# EAGLE design servo_controller_pi (EAGLE 6.4)
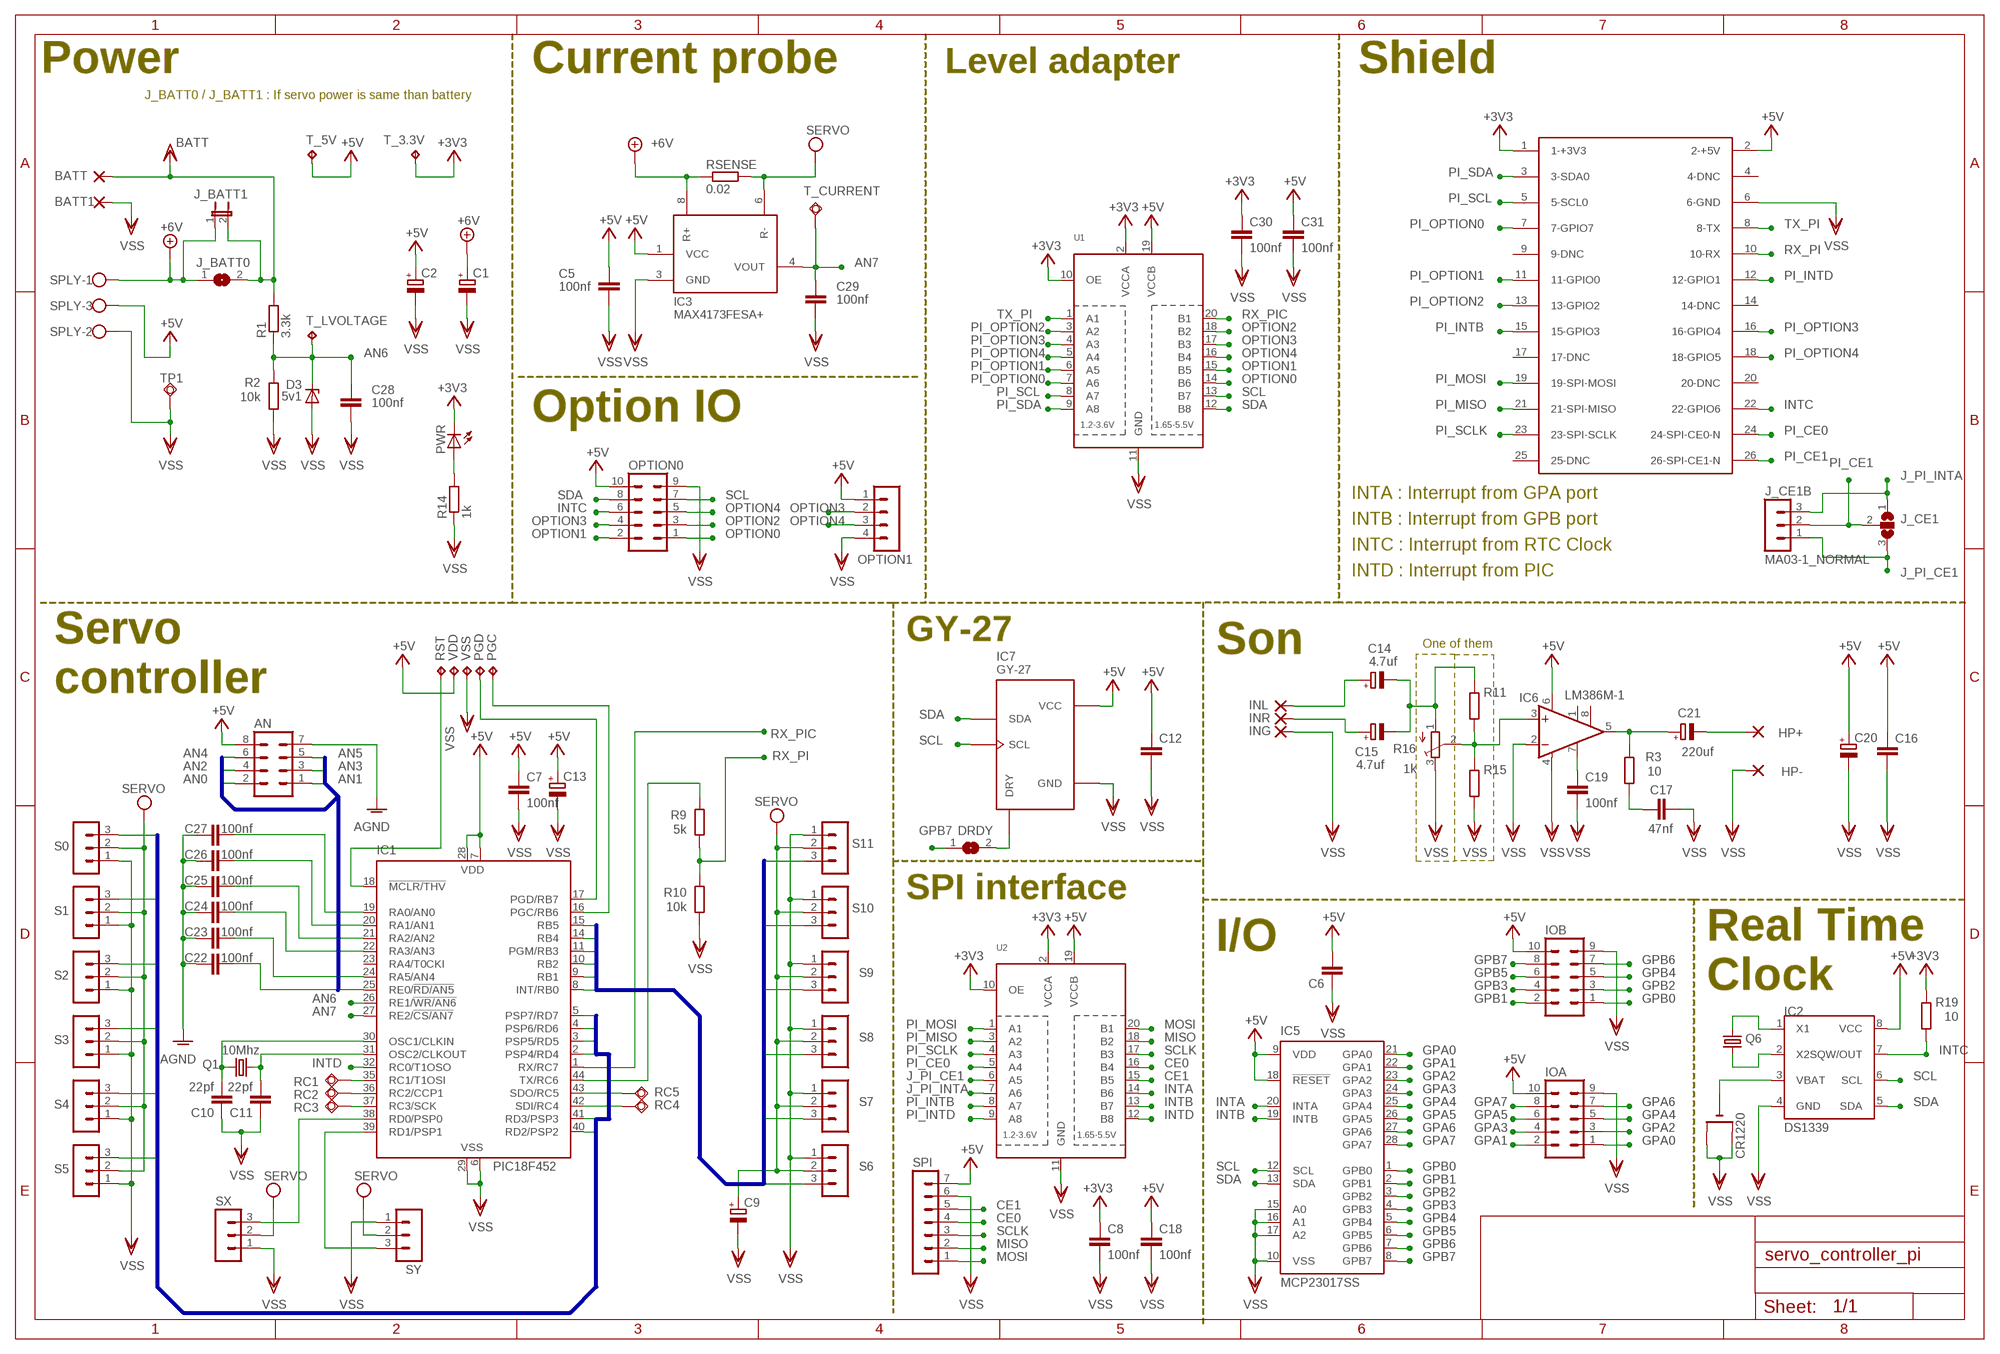
[diagram p0: schematic, sheet 1]

## Parts
AN  MA04-2  [MA04-2]
BATT  2,15/1,0  [2,15/1,0]
BATT1  2,15/1,0  [2,15/1,0]
C1  CPOL-EUF  [PANASONIC_F]
C2  CPOL-EUF  [PANASONIC_F]
C5  100nf  C-EUC0805  [C0805]
C6  C-EUC0805  [C0805]
C7  100nf  C-EUC0805  [C0805]
C8  100nf  C-EUC0805  [C0805]
C9  CPOL-EUD  [PANASONIC_D]
C10  22pf  C-EUC0805  [C0805]
C11  22pf  C-EUC0805  [C0805]
C12  C-EUC0805  [C0805]
C13  CPOL-EUA  [PANASONIC_A]
C14  4.7uf  CPOL-EUA  [PANASONIC_A]
C15  4.7uf  CPOL-EUA  [PANASONIC_A]
C16  C-EUC0805  [C0805]
C17  47nf  C-EUC0805  [C0805]
C18  100nf  C-EUC0805  [C0805]
C19  100nf  C-EUC0805  [C0805]
C20  CPOL-EUA  [PANASONIC_A]
C21  220uf  CPOL-EUD  [PANASONIC_D]
C22  100nf  C-EUC0805  [C0805]
C23  100nf  C-EUC0805  [C0805]
C24  100nf  C-EUC0805  [C0805]
C25  100nf  C-EUC0805  [C0805]
C26  100nf  C-EUC0805  [C0805]
C27  100nf  C-EUC0805  [C0805]
C28  100nf  C-EUC0805  [C0805]
C29  100nf  C-EUC0805  [C0805]
C30  100nf  C-EUC0805  [C0805]
C31  100nf  C-EUC0805  [C0805]
CR1220  CR1220THM  [CR1220-THM]
D3  5v1  ZENER-DIODESOT23  [SOT23]
DRDY  SJ  [SJ]
HP+  2,15/1,0  [2,15/1,0]
HP-  2,15/1,0  [2,15/1,0]
IC1  PIC18F452  PIC16F877PT  [TQFP44]
IC2  DS1339  DS1307  [SOIC-8]
IC3  MAX4173FESA+  MAX4173A  [SO08]
IC5  MCP23017SS  [SSOP28]
IC6  LM386M-1  [SO08]
IC7  GY-27  [GY-27]
ING  2,15/1,0  [2,15/1,0]
INL  2,15/1,0  [2,15/1,0]
INR  2,15/1,0  [2,15/1,0]
IOA  MA05-2  [MA05-2]
IOB  MA05-2  [MA05-2]
J_BATT0  SJ  [SJ]
J_BATT1  JP1E  [JP1]
J_CE1  SJ2W  [SJ_2]
J_CE1B  MA03-1_NORMAL  [MA03-1_NORMAL]
OPTION0  MA05-2  [MA05-2]
OPTION1  MA04-1  [MA04-1]
PGC  TPTP20R  [TP20R]
PGD  TPTP20R  [TP20R]
PWR  LEDCHIPLED_0805  [CHIPLED_0805]
Q1  10Mhz  CRYTALHC49UP  [HC49UP@1]
Q6  CRYSTALTC26H  [TC26H]
R1  3.3k  R-EU_M0805  [M0805]
R2  10k  R-EU_M0805  [M0805]
R3  10  R-EU_M0805  [M0805]
R9  5k  R-EU_M0805  [M0805]
R10  10k  R-EU_M0805  [M0805]
R11  R-EU_M0805  [M0805]
R14  1k  R-EU_M0805  [M0805]
R15  R-EU_M0805  [M0805]
R16  1k  TRIM_EU-3223J  [3223J]
R19  10  R-EU_M0805  [M0805]
RC1  TPSQTP06SQ  [TP06SQ]
RC2  TPSQTP06SQ  [TP06SQ]
RC3  TPSQTP06SQ  [TP06SQ]
RC4  TPSQTP06SQ  [TP06SQ]
RC5  TPSQTP06SQ  [TP06SQ]
RSENSE  0.02  R-EU_R4527  [R4527]
RST  TPTP20R  [TP20R]
S0  MA03-1  [MA03-1]
S1  MA03-1  [MA03-1]
S2  MA03-1  [MA03-1]
S3  MA03-1  [MA03-1]
S4  MA03-1  [MA03-1]
S5  MA03-1  [MA03-1]
S6  MA03-1  [MA03-1]
S7  MA03-1  [MA03-1]
S8  MA03-1  [MA03-1]
S9  MA03-1  [MA03-1]
S10  MA03-1  [MA03-1]
S11  MA03-1  [MA03-1]
SPI  MA07-1  [MA07-1]
SPLY  W237-103  [W237-103]
SX  MA03-1  [MA03-1]
SY  MA03-1  [MA03-1]
T_3.3V  TPB1,27  [B1,27]
T_5V  TPB1,27  [B1,27]
T_CURRENT  TPSQPAD1-13  [P1-13]
T_LVOLTAGE  TPB1,27  [B1,27]
TP1  TPSQPAD1-13  [P1-13]
U1  TXB0108PWR  [TSSOP20]
U2  TXB0108PWR  [TSSOP20]
U$3  RASPBERRY-PILIGHT-HOLE  [RASPBERRY-PI-LIGHT-HOLE]
VDD  TPTP20R  [TP20R]
VSS  TPTP20R  [TP20R]

## Nets
+3V3: C8.1 C30.1 PWR.C R19.2 T_3.3V.TP U1.2(VCCA) U1.10(OE) U2.2(VCCA) U2.10(OE) U$3.1(1-+3V3)
+5V: AN.8 C2.+ C5.1 C6.2 C7.1 C12.1 C13.+ C16.1 C18.1 C20.+ C31.1 IC1.7(VDD) IC1.28(VDD) IC2.8(VCC) IC3.1(VCC) IC5.9(VDD) IC5.18(!RESET) IC6.6(VS) IC7.VCC IOA.10 IOB.10 OPTION0.10 OPTION1.1 SPI.7 SPLY.3 T_5V.TP U1.19(VCCB) U2.19(VCCB) U$3.2(2-+5V) VDD.TP
+7V: C1.+ IC3.8(R+) J_BATT0.1 J_BATT1.1 RSENSE.1 SPLY.1 ; supply symbol labelled +6V
AGND: AN.7 C22.1 C23.1 C24.1 C25.1 C26.1 C27.1
AN0: AN.2 C27.2 IC1.19(RA0/AN0)
AN1: AN.1 C26.2 IC1.20(RA1/AN1)
AN2: AN.4 C25.2 IC1.21(RA2/AN2)
AN3: AN.3 C24.2 IC1.22(RA3/AN3)
AN4: AN.6 C23.2 IC1.24(RA5/AN4)
AN5: AN.5 C22.2 IC1.25(RE0/!RD/AN5)
AN6: C28.2 D3.3(C) IC1.26(RE1/!WR/AN6) R1.1 R2.2 T_LVOLTAGE.TP
AN7: C29.2 IC1.27(RE2/!CS/AN7) IC3.4(VOUT) T_CURRENT.TP
CE0: SPI.4 U2.16(B4)
CE1: SPI.5 U2.15(B5)
GPA0: IC5.21(GPA0) IOA.1
GPA1: IC5.22(GPA1) IOA.2
GPA2: IC5.23(GPA2) IOA.3
GPA3: IC5.24(GPA3) IOA.4
GPA4: IC5.25(GPA4) IOA.5
GPA5: IC5.26(GPA5) IOA.6
GPA6: IC5.27(GPA6) IOA.7
GPA7: IC5.28(GPA7) IOA.8
GPB0: IC5.1(GPB0) IOB.1
GPB1: IC5.2(GPB1) IOB.2
GPB2: IC5.3(GPB2) IOB.3
GPB3: IC5.4(GPB3) IOB.4
GPB4: IC5.5(GPB4) IOB.5
GPB5: IC5.6(GPB5) IOB.6
GPB6: IC5.7(GPB6) IOB.7
GPB7: DRDY.1 IC5.8(GPB7) IOB.8
INTA: IC5.20(INTA) U2.14(B6)
INTB: IC5.19(INTB) U2.13(B7)
INTC: IC2.7(SQW/OUT) OPTION0.6 R19.1 U$3.22(22-GPIO6)
INTD: IC1.32(RC0/T1OSO) U2.12(B8)
J_PI_CE1: J_CE1.3 J_CE1B.1 U2.6(A5)
J_PI_INTA: J_CE1.1 J_CE1B.3 U2.7(A6)
MISO: SPI.2 U2.18(B2)
MOSI: SPI.1 U2.20(B1)
N$1: IC1.35(RC1/T1OSI) RC1.TP
N$2: IC1.36(RC2/CCP1) RC2.TP
N$3: IC1.37(RC3/SCK) RC3.TP
N$7: C14.- C15.- R11.2 R16.1(A)
N$8: C14.+ INL.1(P)
N$9: C21.- HP+.1(P)
N$16: IC1.44(TX/RC6) R9.2
N$19: IC1.38(RD0/PSP0) SX.3
N$22: IC1.17(PGD/RB7) PGD.TP
N$23: IC1.16(PGC/RB6) PGC.TP
N$24: IC1.39(RD1/PSP1) SY.3
N$25: C11.2 IC1.31(OSC2/CLKOUT) Q1.1
N$27: C10.2 IC1.30(OSC1/CLKIN) Q1.2
N$33: IC2.1(X1) Q6.1
N$34: IC2.2(X2) Q6.2
N$36: DRDY.2 IC7.DRY
N$39: PWR.A R14.2
N$40: C15.+ INR.1(P)
N$41: IC6.3(+IN) R11.1 R15.2 R16.2(S)
N$42: C21.+ IC6.5(OUT) R3.2
N$43: C17.1 R3.1
N$47: C19.1 IC6.7(BYPASS)
N$55: IC1.42(SDI/RC4) RC4.TP
N$56: IC1.43(SDO/RC5) RC5.TP
N$58: CR1220.- IC2.3(VBAT)
OPTION0: OPTION0.1 U1.14(B6)
OPTION1: OPTION0.2 U1.15(B5)
OPTION2: OPTION0.3 U1.18(B2)
OPTION3: OPTION0.4 OPTION1.2 U1.17(B3)
OPTION4: OPTION0.5 OPTION1.3 U1.16(B4)
PI_CE0: U2.5(A4) U$3.24(24-SPI-CE0-N)
PI_CE1: J_CE1.2 J_CE1B.2 U$3.26(26-SPI-CE1-N)
PI_INTB: U2.8(A7) U$3.15(15-GPIO3)
PI_INTD: U2.9(A8) U$3.12(12-GPIO1)
PI_MISO: U2.3(A2) U$3.21(21-SPI-MISO)
PI_MOSI: U2.1(A1) U$3.19(19-SPI-MOSI)
PI_OPTION0: U1.7(A6) U$3.7(7-GPIO7)
PI_OPTION1: U1.6(A5) U$3.11(11-GPIO0)
PI_OPTION2: U1.3(A2) U$3.13(13-GPIO2)
PI_OPTION3: U1.4(A3) U$3.16(16-GPIO4)
PI_OPTION4: U1.5(A4) U$3.18(18-GPIO5)
PI_SCL: U1.8(A7) U$3.5(5-SCL0)
PI_SCLK: U2.4(A3) U$3.23(23-SPI-SCLK)
PI_SDA: U1.9(A8) U$3.3(3-SDA0)
RX_PI: R9.1 R10.2 U$3.10(10-RX)
RX_PIC: IC1.1(RX/RC7) U1.20(B1)
SCL: IC2.6(SCL) IC5.12(SCL) IC7.SCL OPTION0.7 U1.13(B7)
SCLK: SPI.3 U2.17(B3)
SDA: IC2.5(SDA) IC5.13(SDA) IC7.SDA OPTION0.8 U1.12(B8)
SS0: IC1.40(RD2/PSP2) S0.3
SS1: IC1.41(RD3/PSP3) S1.3
SS2: IC1.2(PSP4/RD4) S2.3
SS3: IC1.3(PSP5/RD5) S3.3
SS4: IC1.4(PSP6/RD6) S4.3
SS5: IC1.5(PSP7/RD7) S5.3
SS6: IC1.8(INT/RB0) S6.3
SS7: IC1.9(RB1) S7.3
SS8: IC1.10(RB2) S8.3
SS9: IC1.11(PGM/RB3) S9.3
SS10: IC1.14(RB4) S10.3
SS11: IC1.15(RB5) S11.3
TX_PI: U1.1(A1) U$3.8(8-TX)
UC_RESET: IC1.18(!MCLR/THV) RST.TP
VDD: BATT.1(P) J_BATT0.2 J_BATT1.2 R1.2 ; supply symbol labelled BATT
VEE: C9.+ IC3.6(R-) RSENSE.2 S0.2 S1.2 S2.2 S3.2 S4.2 S5.2 S6.2 S7.2 S8.2 S9.2 S10.2 S11.2 SX.2 SY.2 ; supply symbol labelled SERVO
VSS: BATT1.1(P) C1.- C2.- C5.2 C6.1 C7.2 C8.2 C9.- C10.1 C11.1 C12.2 C13.- C16.2 C17.2 C18.2 C19.2 C20.- C28.1 C29.1 C30.2 C31.2 CR1220.+1(+) CR1220.+2(+1) D3.1(A) HP-.1(P) IC1.6(VSS) IC1.29(VSS) IC2.4(GND) IC3.3(GND) IC5.10(VSS) IC5.15(A0) IC5.16(A1) IC5.17(A2) IC6.2(-IN) IC6.4(GND) IC7.GND ING.1(P) IOA.9 IOB.9 OPTION0.9 OPTION1.4 R2.1 R10.1 R14.1 R15.1 R16.3(E) S0.1 S1.1 S2.1 S3.1 S4.1 S5.1 S6.1 S7.1 S8.1 S9.1 S10.1 S11.1 SPI.6 SPLY.2 SX.1 SY.1 TP1.TP U1.11(GND) U2.11(GND) U$3.6(6-GND) VSS.TP
Unconnected: IC1.23(RA4/T0CKI) IC6.1(GAIN) IC6.8(GAIN) U$3.4(4-DNC) U$3.9(9-DNC) U$3.14(14-DNC) U$3.17(17-DNC) U$3.20(20-DNC) U$3.25(25-DNC)

## Buses
SS[0..5]
SS[6..11]
AN[0..5]

## Notes on the sheet
- Power | Current probe | Level adapter | Shield
- J_BATT0 / J_BATT1 : If servo power is same than battery
- Option IO
- INTA : Interrupt from GPA port
- INTB : Interrupt from GPB port
- INTC : Interrupt from RTC Clock
- INTD : Interrupt from PIC
- GY-27
- One of them
- Son
- Servo
  controller
- SPI interface
- I/O
- Real Time
  Clock

## Library data of the parts
AN = con-lstb:MA04-2: PIN HEADER; OC_FARNELL: unknown; OC_NEWARK: unknown
BATT BATT1 HP+ HP- ING INL INR = wirepad:2,15/1,0: THROUGH-HOLE PAD
C1 C2 C9 C13-C15 C20 C21 = rcl:CPOL-EU: POLARIZED CAPACITOR, European symbol
C5-C8 C10-C12 C16-C19 C22-C31 = rcl:C-EU: CAPACITOR, European symbol
CR1220 = adafruit:CR1220: CR1216/CR1220/CR1225 12mm 3V lithium coin cell Great for battery packup. Both SMT and THM holders. Note the THM package has the ground pads on both sides of the PCB so that the masks are the same - this reduces the cost
D3 = diode:ZENER-DIODE: Z-Diode
DRDY J_BATT0 = jumper:SJ: SMD solder JUMPER
IC1 = microchip:PIC16F87*: MICROCONTROLLER; MF: MICROCHIP; MPN: PIC16F877-04/PQ; OC_FARNELL: 9761411; OC_NEWARK: 23C5094
IC2 = eagleParts:DS1307: I2C Serial RTC w/56 bytes battery backed RAM
IC3 = AWJLEagleLib:MAX4173: Maxim MAX4173 high side current monitor SOT363 pin 2 goes to GND
IC5 = adafruit:MCP23017: http://ww1.microchip.com/downloads/en/DeviceDoc/21952a.pdf Source: http://ww1.microchip.com/downloads/en/DeviceDoc/21952a.pdf
IC6 = linear:LM386?-*: Low Voltage Audio Power Amplifier Source: http://cache.national.com/ds/LM/LM386.pdf
IC7 = gy-27:GY-27
IOA IOB OPTION0 = con-lstb:MA05-2: PIN HEADER; OC_FARNELL: unknown; OC_NEWARK: unknown
J_BATT1 = jumper:JP1E: JUMPER
J_CE1 = jumper:SJ2W: SMD solder JUMPER
J_CE1B = con-lstb:MA03-1_NORMAL
OPTION1 = con-lstb:MA04-1: PIN HEADER; OC_FARNELL: unknown; OC_NEWARK: unknown
PGC PGD RST T_3.3V T_5V T_LVOLTAGE VDD VSS = testpad:TP: Test pad
PWR = led:LED: LED OSRAM: - CHIPLED LG R971, LG N971, LY N971, LG Q971, LY Q971, LO R971, LY R971 LH N974, LH R974 LS Q976, LO Q976, LY Q976 LO Q996 - Hyper CHIPLED LW Q18S LB Q993, LB Q99A, LB R99A - SideLED LS A670, LO A670, LY A670, LG A670, LP A670 LB A673, LV A673, LT A673, LW A673 LH A674 LY A675 LS A676, LA A676, LO A676, LY A676, LW A676 LS A679, LY A679, LG A679 - Hyper Micro SIDELED® LS Y876, LA Y876, LO Y876, LY Y876 LT Y87S - SmartLED LW L88C, LW L88S LB L89C, LB L89S, LG L890 LS L89K, LO L89K, LY L89K LS L896, LA L896, LO L896, LY L896 - TOPLED LS T670, LO T670, LY T670, LG T670, LP T670 LSG T670, LSP T670, LSY T670, LOP T670, LYG T670 LG T671, LOG T671, LSG T671 LB T673, LV T673, LT T673, LW T673 LH T674 LS T676, LA T676, LO T676, LY T676, LB T676, LH T676, LSB T676, LW T676 LB T67C, LV T67C, LT T67C, LS T67K, LO T67K, LY T67K, LW E67C LS E67B, LA E67B, LO E67B, LY E67B, LB E67C, LV E67C, LT E67C LW T67C LS T679, LY T679, LG T679 LS T770, LO T770, LY T770, LG T770, LP T770 LB T773, LV T773, LT T773, LW T773 LH T774 LS E675, LA E675, LY E675, LS T675 LS T776, LA T776, LO T776, LY T776, LB T776 LHGB T686 LT T68C, LB T68C - Hyper Mini TOPLED® LB M676 - Mini TOPLED Santana® LG M470 LS M47K, LO M47K, LY M47K Source: http://www.osram.convergy.de LUXEON: - LUMILED® LXK2-PW12-R00, LXK2-PW12-S00, LXK2-PW14-U00, LXK2-PW14-V00 LXK2-PM12-R00, LXK2-PM12-S00, LXK2-PM14-U00 LXK2-PE12-Q00, LXK2-PE12-R00, LXK2-PE12-S00, LXK2-PE14-T00, LXK2-PE14-U00 LXK2-PB12-K00, LXK2-PB12-L00, LXK2-PB12-M00, LXK2-PB14-N00, LXK2-PB14-P00, LXK2-PB14-Q00 LXK2-PR12-L00, LXK2-PR12-M00, LXK2-PR14-Q00, LXK2-PR14-R00 LXK2-PD12-Q00, LXK2-PD12-R00, LXK2-PD12-S00 LXK2-PH12-R00, LXK2-PH12-S00 LXK2-PL12-P00, LXK2-PL12-Q00, LXK2-PL12-R00 Source: www.luxeon.com KINGBRIGHT: KA-3528ASYC Source: www.kingbright.com
Q1 = crystal:CRYTAL: CRYSTAL
Q6 = crystal:CRYSTAL: CRYSTAL; OC_FARNELL: unknown; OC_NEWARK: unknown
R1-R3 R9-R11 R14 R15 R19 RSENSE = rcl:R-EU_: RESISTOR, European symbol
R16 = pot:TRIM_EU-: POTENTIOMETER
RC1-RC5 T_CURRENT TP1 = testpad:TPSQ: Test pad
S0 S1-S11 SX SY = con-lstb:MA03-1: PIN HEADER; OC_FARNELL: unknown; OC_NEWARK: unknown
SPI = con-lstb:MA07-1: PIN HEADER; OC_FARNELL: unknown; OC_NEWARK: unknown
SPLY = con-wago-500:W237-103: WAGO SCREW CLAMP; MPN: 237-103; OC_FARNELL: unknown; OC_NEWARK: 18M7116
U1 U2 = adafruit:TXB0108PWR: 8-Bit Bi-Directional Level Shifter 1.2V-3.6V (VCCA) to 1.65V-5.5V (VCCB) bi-directional level shifter with auto direction sensing. Max data rate - VCCA 1.8V: 20Mbps (50ns), VCCA 3.3V: 100Mbps (10ns) Digikey: 296-21527-1-ND
U$3 = RaspberryPi:RASPBERRY-PI: Raspberry Pi Board <http://www.raspberrypi.org/> Jacques Lagnel V1.0 (beta) 2012 Board dimension: Forum 3D model <http://www.raspberrypi.org/forum/general-discussion/mechanical-profile-3d-models?value=3d%20model&type=1&include=1&search=1&ret=all> The GPIO Connector (P1): http://elinux.org/RPi_Low-level_peripherals

## Board
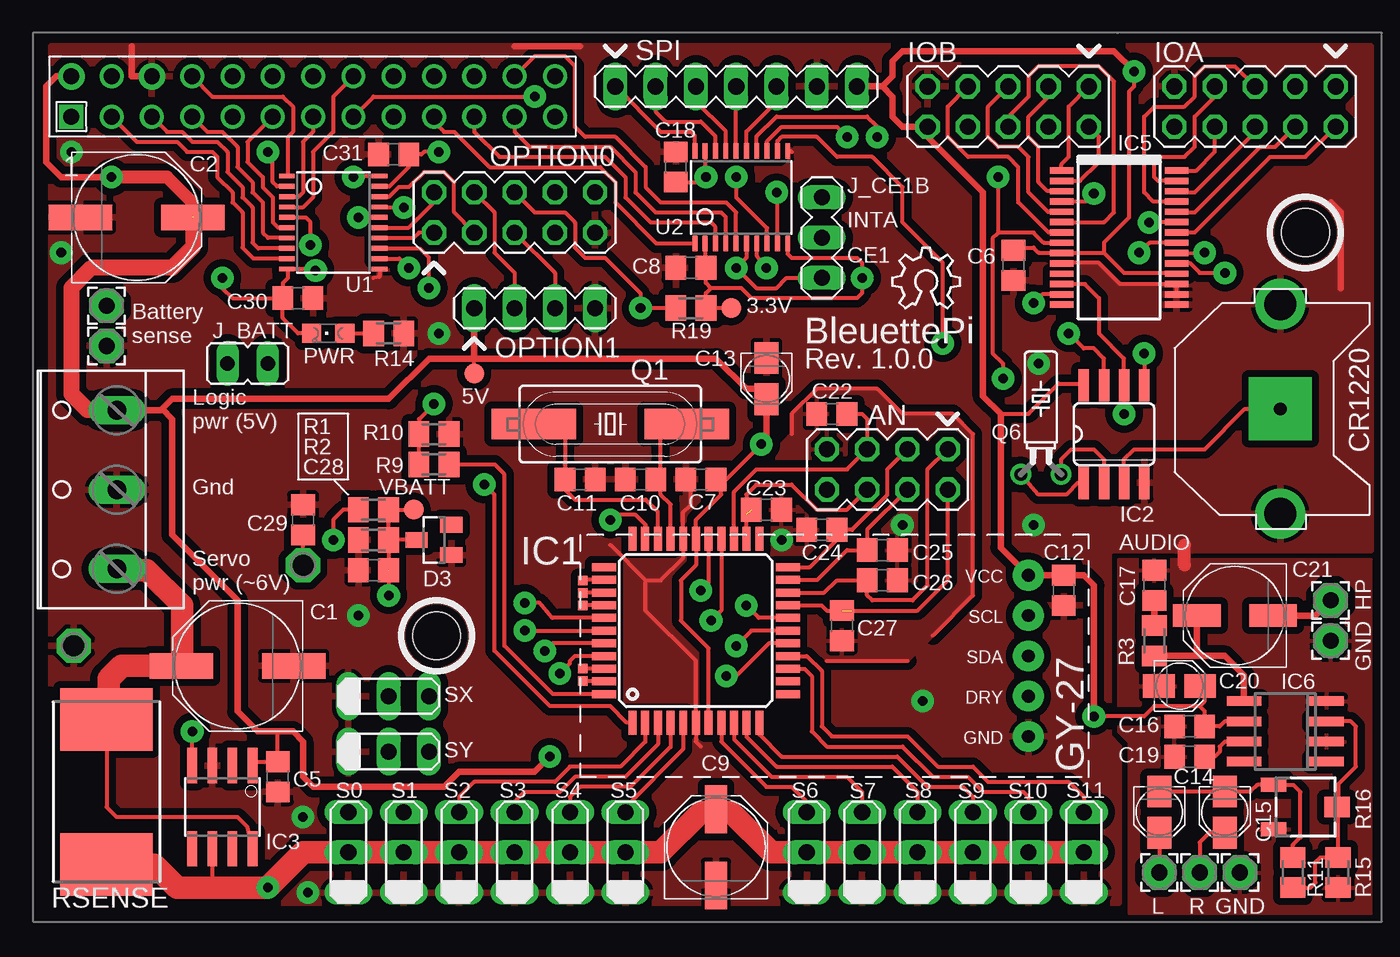
[diagram p1: board, top side]
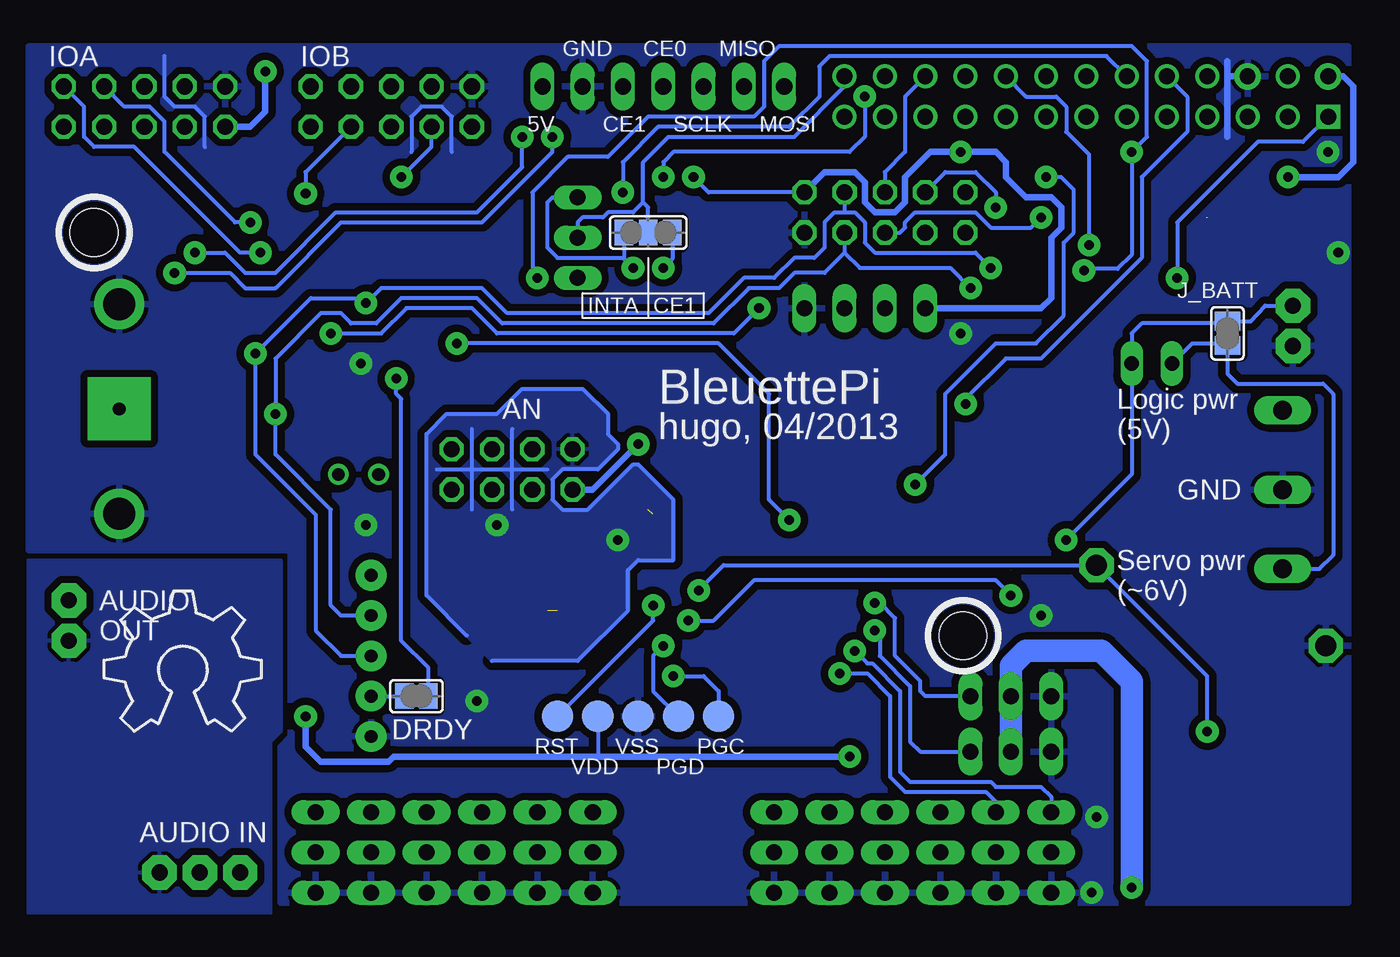
[diagram p2: board, bottom side, seen from below]

No outline drawn. Coordinates in mm, seen from the top.
Copper layers (1*16): Top 0.035mm / dielectric 1.5mm / Bottom 0.035mm
Design rules "Fusion_eagle_rule_v1.1": minimum track width 6mil, minimum drill 12mil, track to track 6mil, track to pad 6mil, pad to pad 6mil, via to via 6mil, smd to smd 0mil, copper to edge 10mil, drill to drill 10mil, minimum pad ring 10mil, minimum via ring 6mil, stop-mask expansion 2mil, vias tented up to drill 100mil, thermal gap 10mil

### Footprints (pad centres in the part's own frame; a part is rotated, then mirrored left to right if it is on the bottom)
MA04-2 = drill 1.016 octagon: 1 -3.81,-1.27; 2 -3.81,1.27; 3 -1.27,-1.27; 4 -1.27,1.27; 5 1.27,-1.27; 6 1.27,1.27; 7 3.81,-1.27; 8 3.81,1.27
2,15/1,0 = drill 1.016 pad 2.159 octagon: 1 0,0
PANASONIC_F = smd 4 x 1.6: + 3.55,0; - -3.55,0
C0805 = smd 1.3 x 1.5: 1 -0.95,0; 2 0.95,0
PANASONIC_D = smd 3 x 1.4: + 2.4,0; - -2.4,0
PANASONIC_A = smd 2 x 1.5: + 1.3,0; - -1.3,0
CR1220-THM = drill 2 pad 3.175: +1 -6.604,0; +2 6.604,0 | drill 0.8 pad 3.962 square: - 0,0
SOT23 = smd 1 x 1.4: 1 -0.95,-1.1; 2 0.95,-1.1; 3 0,1.1
SJ = smd 1.168 x 1.6: 1 -0.762,0; 2 0.762,0
TQFP44 = smd 1.5 x 0.5: 1 -5.8,4; 2 -5.8,3.2; 3 -5.8,2.4; 4 -5.8,1.6; 5 -5.8,0.8; 6 -5.8,0; 7 -5.8,-0.8; 8 -5.8,-1.6; 9 -5.8,-2.4; 10 -5.8,-3.2; 11 -5.8,-4; 23 5.8,-4; 24 5.8,-3.2; 25 5.8,-2.4; 26 5.8,-1.6; 27 5.8,-0.8; 28 5.8,0; 29 5.8,0.8; 30 5.8,1.6; 31 5.8,2.4; 32 5.8,3.2; 33 5.8,4 | smd 0.5 x 1.5: 12 -4,-5.8; 13 -3.2,-5.8; 14 -2.4,-5.8; 15 -1.6,-5.8; 16 -0.8,-5.8; 17 0,-5.8; 18 0.8,-5.8; 19 1.6,-5.8; 20 2.4,-5.8; 21 3.2,-5.8; 22 4,-5.8; 34 4,5.8; 35 3.2,5.8; 36 2.4,5.8; 37 1.6,5.8; 38 0.8,5.8; 39 0,5.8; 40 -0.8,5.8; 41 -1.6,5.8; 42 -2.4,5.8; 43 -3.2,5.8; 44 -4,5.8
SOIC-8 = smd 2.032 x 0.66: 1 -3.073,1.27; 2 -3.073,0; 3 -3.073,-1.27; 4 -3.073,-2.54; 5 3.073,-2.54; 6 3.073,-1.27; 7 3.073,0; 8 3.073,1.27
SO08 = smd 0.61 x 2.21: 1 -1.905,-2.616; 2 -0.635,-2.616; 3 0.635,-2.616; 4 1.905,-2.616; 5 1.905,2.616; 6 0.635,2.616; 7 -0.635,2.616; 8 -1.905,2.616
SSOP28 = smd 0.4 x 1.5: 1 -4.225,-3.625; 2 -3.575,-3.625; 3 -2.925,-3.625; 4 -2.275,-3.625; 5 -1.625,-3.625; 6 -0.975,-3.625; 7 -0.325,-3.625; 8 0.325,-3.625; 9 0.975,-3.625; 10 1.625,-3.625; 11 2.275,-3.625; 12 2.925,-3.625; 13 3.575,-3.625; 14 4.225,-3.625; 15 4.225,3.625; 16 3.575,3.625; 17 2.925,3.625; 18 2.275,3.625; 19 1.625,3.625; 20 0.975,3.625; 21 0.325,3.625; 22 -0.325,3.625; 23 -0.975,3.625; 24 -1.625,3.625; 25 -2.275,3.625; 26 -2.925,3.625; 27 -3.575,3.625; 28 -4.225,3.625
SO08' = smd 0.6 x 2.2: 1 -1.905,-2.6; 2 -0.635,-2.6; 3 0.635,-2.6; 4 1.905,-2.6; 5 1.905,2.6; 6 0.635,2.6; 7 -0.635,2.6; 8 -1.905,2.6
GY-27 = drill 0.8 pad 1.93: DRY 3.81,10.16; GND 3.81,12.7; SCL 3.81,5.08; SDA 3.81,7.62; VCC 3.81,2.54
MA05-2 = drill 1.016 octagon: 1 -5.08,-1.27; 2 -5.08,1.27; 3 -2.54,-1.27; 4 -2.54,1.27; 5 0,-1.27; 6 0,1.27; 7 2.54,-1.27; 8 2.54,1.27; 9 5.08,-1.27; 10 5.08,1.27
JP1 = drill 0.914 long: 1 0,-1.27; 2 0,1.27
SJ_2 = smd 1.168 x 1.6: 1 -1.524,0; 2 0,0; 3 1.524,0
MA03-1_NORMAL = drill 1.016 long: 1 -3.81,0; 2 -1.27,0; 3 1.27,0
MA04-1 = drill 1.016 long: 1 -3.81,0; 2 -1.27,0; 3 1.27,0; 4 3.81,0
TP20R = smd 2 x 2: TP 0,0
CHIPLED_0805 = smd 1.2 x 1.2: A 0,-1.05; C 0,1.05
HC49UP@1 = smd 5.334 x 1.93: 1 -4.826,0; 2 4.826,0
TC26H = drill 0.813: 1 -1.27,0; 2 1.27,0
M0805 = smd 1.3 x 1.6: 1 -0.95,0; 2 0.95,0
3223J = smd 1.6 x 0.9: 1 -2,1.4; 3 -2,-1.4 | smd 1.6 x 1.3: 2 2,0
TP06SQ = smd 0.6 x 0.6: TP 0,0
R4527 = smd 3.94 x 5.84: 1 -4.575,0; 2 4.575,0
MA03-1 = drill 1.016 long: 1 -2.54,0; 2 0,0; 3 2.54,0
MA07-1 = drill 1.016 long: 1 -7.62,0; 2 -5.08,0; 3 -2.54,0; 4 0,0; 5 2.54,0; 6 5.08,0; 7 7.62,0
W237-103 = drill 1.194 long: 1 -5,-1.29; 2 0,-1.29; 3 5,-1.29
B1,27 = smd 1.27 x 1.27: TP 0,0
P1-13 = drill 1.321 pad 2.159 octagon: TP 0,0
TSSOP20 = smd 0.305 x 0.991: 1 -2.925,-2.918; 2 -2.275,-2.918; 3 -1.625,-2.918; 4 -0.975,-2.918; 5 -0.325,-2.918; 6 0.325,-2.918; 7 0.975,-2.918; 8 1.625,-2.918; 9 2.275,-2.918; 10 2.925,-2.918; 11 2.925,2.918; 12 2.275,2.918; 13 1.625,2.918; 14 0.975,2.918; 15 0.325,2.918; 16 -0.325,2.918; 17 -0.975,2.918; 18 -1.625,2.918; 19 -2.275,2.918; 20 -2.925,2.918
RASPBERRY-PI-LIGHT-HOLE = drill 1 square: 1 -39.37,22.86 | drill 1 pad 1.676: 2 -39.37,25.4; 6 -34.29,25.4 | drill 1: 3 -36.83,22.86; 4 -36.83,25.4; 5 -34.29,22.86; 7 -31.75,22.86; 8 -31.75,25.4; 9 -29.21,22.86; 10 -29.21,25.4; 11 -26.67,22.86; 12 -26.67,25.4; 13 -24.13,22.86; 14 -24.13,25.4; 15 -21.59,22.86; 16 -21.59,25.4; 17 -19.05,22.86; 18 -19.05,25.4; 19 -16.51,22.86; 20 -16.51,25.4; 21 -13.97,22.86; 22 -13.97,25.4; 23 -11.43,22.86; 24 -11.43,25.4; 25 -8.89,22.86; 26 -8.89,25.4 | hole 3: -16.351,-9.842; 38.417,15.557

### Placement (x,y rotation side)
AN  53.98,28.57 180 top
BATT  4.76,38.89 0 top
BATT1  4.76,36.35 0 top
C1  13.02,16.19 180 top
C2  6.67,44.45 0 top
C5  15.56,9.21 270 top
C6  61.91,41.43 90 top
C7  42.23,27.94 180 top
C8  41.59,41.27 180 top
C9  43.18,4.76 90 top
C10  38.42,27.94 0 top
C11  34.61,27.94 180 top
C12  65.09,20.95 270 top
C13  46.35,34.29 270 top
C14  71.12,6.99 270 top
C15  75.25,6.99 270 top
C16  73.03,12.38 180 top
C17  70.8,21.27 90 top
C18  40.64,47.62 90 top
C19  73.03,10.48 180 top
C20  72.39,14.92 0 top
C21  75.88,19.37 180 top
C22  50.48,32.07 0 top
C23  46.35,26.04 180 top
C24  49.85,24.77 0 top
C25  53.66,23.5 180 top
C26  53.66,21.59 180 top
C27  51.12,18.73 90 top
C28  21.59,22.23 0 top
C29  17.14,25.4 270 top
C30  16.83,39.37 0 top
C31  22.86,48.42 180 top
CR1220  78.74,32.38 270 top
D3  25.4,24.13 90 top
DRDY  60.01,14.29 180 bottom
HP+  81.92,20.32 0 top
HP-  81.92,17.78 0 top
IC1  41.91,18.41 90 top
IC2  67.63,30.8 90 top
IC3  12.06,7.3 180 top
IC5  68.58,43.18 270 top
IC6  LM386M-1  [SO08']  79.06,12.06 90 top
IC7  66.67,24.45 180 top
ING  76.2,3.17 0 top
INL  71.12,3.17 0 top
INR  73.66,3.17 0 top
IOA  77.15,51.44 180 top
IOB  61.59,51.44 180 top
J_BATT0  8.89,37.15 90 bottom
J_BATT1  13.65,35.24 270 top
J_CE1  45.4,43.5 0 bottom
J_CE1B  49.85,44.45 90 top
OPTION0  30.48,44.77 0 top
OPTION1  31.75,38.73 0 top
PGC  40.96,13.02 90 bottom
PGD  43.5,13.02 90 bottom
PWR  18.73,37.15 90 top
Q1  36.51,31.43 0 top
Q6  63.66,28.26 0 top
R1  21.59,26.04 180 top
R2  21.59,24.13 0 top
R3  70.8,17.78 270 top
R9  25.4,28.89 0 top
R10  25.4,30.8 180 top
R11  79.53,3.17 90 top
R14  22.54,37.15 180 top
R15  82.39,3.17 90 top
R16  80.33,7.3 0 top
R19  41.59,38.73 0 top
RC1  34.77,21.59 180 top
RC2  34.77,20.8 180 top
RC3  34.77,20 180 top
RC4  34.77,16.03 0 top
RC5  34.77,15.24 0 top
RSENSE  4.76,8.26 270 top
RST  51.12,13.02 90 bottom
S0  20,4.45 90 top
S1  23.5,4.45 90 top
S2  26.99,4.45 90 top
S3  30.48,4.45 90 top
S4  33.97,4.45 90 top
S5  37.47,4.45 90 top
S6  48.9,4.45 90 top
S7  52.39,4.45 90 top
S8  55.88,4.45 90 top
S9  59.37,4.45 90 top
S10  62.87,4.45 90 top
S11  66.36,4.45 90 top
SPI  44.45,52.7 0 top
SPLY  4.13,27.3 90 top
SX  22.54,14.29 0 top
SY  22.54,10.79 0 top
T_3.3V  44.13,38.73 0 top
T_5V  27.94,34.61 0 top
T_CURRENT  17.14,22.54 0 top
T_LVOLTAGE  24.13,26.04 0 top
TP1  2.7,17.46 0 top
U1  19.05,44.13 270 top
U2  44.77,45.72 0 top
U$2  [OSHW_8X350_NOTEXT]  79.69,12.06 0 bottom
U$3  41.91,27.94 0 top
U$5  [OSHW_6X150_NOTEXT]  54.29,38.73 0 top
VDD  48.58,13.02 90 bottom
VSS  46.04,13.02 90 bottom

### Tracks (layer width: path | path; a pad name or v marks a point on that pad's centre or on a via)
+3V3  (via drill 0.6 pad 1.42)
  Top 0.254: 15.56,40 C30.1 | U1.2 15.51,46.41 15.24,46.67 15.24,48.26 v14.92,48.58 | U2.10 47.69,42.16 47.94,41.91 52.07,41.91 52.39,41.59 v52.39,40.64 52.39,39.69 52.07,39.37 45.4,39.37 44.77,40.01 42.86,40.01 | U2.2 42.49,41.33 C8.1 42.55,40.32 42.86,40.01 | 42.86,40.01 42.54,39.69 R19.2 T_3.3V.TP | v12.06,40.64 12.06,40.01 12.7,39.37 C30.1 | PWR.C 16.83,37.15 15.88,38.1 C30.1 | v17.94,41.12 17.85,41.21 U1.10 16.19,41.15 16.19,40.64 15.88,40.33 C30.1
  Bottom 0.254: U$3.1 4.13,49.21 6.99,49.21 12.06,44.13 v12.06,40.64 | v17.94,41.12 17.85,41.21 15.81,41.21 14.92,42.1 v14.92,48.58 13.97,49.53 13.97,54.29 14.92,55.24 37.15,55.24 38.1,54.29 38.1,51.44 38.73,50.8 45.4,50.8 47.94,48.26 50.48,48.26 52.7,46.04 52.7,40.96 v52.39,40.64
+5V  (via drill 0.6 pad 1.42)  (1 unrouted)
  Top 0.254: 43.5,27.94 43.5,26.99 41.91,25.4 IC1.28 41.91,22.54 40.96,21.59 40.96,19.05 42.71,17.3 IC1.7 | 43.5,27.94 C7.1 | 43.5,27.94 43.81,27.94 v46.04,30.16 | IC3.1 13.97,10.16 C5.1 15.56,12.06 | 67.65,42.2 68.9,40.96 72.15,40.96 IC5.18 | IC6.6 75.25,12.7 74.93,12.38 C16.1 73.97,13.34 73.66,13.65 | 73.97,14.89 C20.+ 73.98,14.89 73.98,13.97 73.66,13.65 | 73.66,13.65 70.8,13.65 70.17,13.02 v66.99,13.02 | C12.1 | C18.1 42.23,46.67 v42.55,46.99 42.49,47.04 U2.19 | v25.71,48.58 24.77,48.58 24.61,48.42 C31.1 23.81,47.62 22.59,46.41 U1.19 | C6.2 61.91,42.55 63.18,42.55 63.5,42.23 64.93,42.23 IC5.9 67.65,42.2 | 67.65,42.2 67.65,42.88 69.22,44.45 69.22,52.39 69.53,52.7 v69.53,53.66 | 61.12,32.07 62.87,32.07 64.77,33.97 66.26,33.97 IC2.8 | T_5V.TP 27.94,35.56
  Top 0.406: v32.7,10.48 31.75,9.53 26.99,9.53 26.04,8.57 17.78,8.57 17.14,9.21 17.14,11.43 16.51,12.06 15.56,12.06 14.29,12.06 13.02,13.34 13.02,20.32 8.89,24.45 8.89,31.75 8.26,32.38 | v5.08,46.99 1.91,46.99 0.95,47.94 0.95,52.7 1.59,53.34 U$3.2 | 27.94,35.56 25.08,35.56 22.54,33.02 8.89,33.02 8.26,32.38 | 27.94,35.56 43.18,35.56 45.09,33.66 46.33,33.66 C13.+ 46.35,30.48 v46.04,30.16 | OPTION1.1 27.94,35.56 | 53.66,52.7 54.29,52.07 54.29,50.8 54.93,50.16 IOB.10 56.52,49.53 60.01,46.04 60.01,33.18 61.12,32.07 61.12,23.65 IC7.VCC C12.1 66.36,21.91 66.99,21.27 v66.99,13.02 | SPI.7 53.66,52.7 | 53.66,52.7 54.29,53.34 54.29,54.29 54.93,54.93 68.26,54.93 v69.53,53.66 | SPLY.3 8.18,32.3 8.26,32.38
  Top 0.813: 10.16,44.45 10.16,45.4 8.57,46.99 v5.08,46.99
  Top 1.016: C2.+ 10.22,42.6 8.89,41.27 3.81,41.27 2.54,40.01 2.54,33.34 3.57,32.3 SPLY.3
  Bottom 0.254: VDD.TP 48.58,10.48 | OPTION0.10 41.59,46.04 v42.55,46.99
  Bottom 0.406: v66.99,13.02 66.99,11.11 66.04,10.16 61.75,10.16 61.44,10.48 48.58,10.48 v32.7,10.48 | v5.08,46.99 1.91,46.99 0.95,47.94 0.95,52.7 1.59,53.34 U$3.2 | v69.53,53.66 69.53,51.12 70.48,50.16 IOA.10 | OPTION1.1 20.64,38.73 20,39.37 20,43.18 19.37,43.81 19.37,45.09 20,45.72 21.59,45.72 22.86,46.99 22.86,47.94 23.5,48.58 v25.71,48.58 27.62,48.58 29.21,46.99 29.21,45.4 29.84,44.77 31.11,44.77 31.75,45.4 31.75,46.67 32.38,47.31 34.29,47.31 OPTION0.10 | v46.04,30.16 48.9,27.3 AN.8
+7V
  Top 0.254: RSENSE.1 4.76,7.3 5.4,6.67 13.02,6.67 13.65,6.03 IC3.8
  Top 1.422: RSENSE.1 4.89,13.34 4.89,15.37 5.71,16.19 C1.+ | C1.+ 8.89,16.19 | C1.+ 9.53,16.45 9.53,20 7.3,22.23 5.5,22.23 SPLY.1
  Bottom 0.254: J_BATT1.1 11.11,36.51 9.65,36.51 J_BATT0.1 8.89,34.61 8.26,33.97 2.86,33.97 2.22,33.34 2.22,23.18 3.1,22.3 SPLY.1
AGND  (via drill 0.6 pad 1.42)
  Top 0.254: 50.16,16.51 55.24,16.51 | 47.94,30.8 47.94,32.07 49.53,33.66 53.34,33.66 54.93,32.07 58.1,32.07 59.37,30.8 59.37,20.64 56.83,18.1
  Bottom 0.254: 55.24,16.51 49.85,16.51 46.67,19.68 46.67,22.23 46.04,22.86 43.81,22.86 43.81,26.67 46.04,28.89 46.35,28.89 49.21,26.04 50.8,26.04 51.44,26.67 51.44,27.94 50.8,28.57 48.58,28.57 47.31,29.84 47.31,30.16 47.94,30.8 47.94,32.07 49.53,33.66 53.34,33.66 54.93,32.07 58.1,32.07 59.37,30.8 59.37,20.64 56.83,18.1 | 58.74,28.57 51.75,28.57 | 56.52,26.04 56.52,31.11 | 53.98,26.04 53.98,31.11
  other vias: 47.31,24.13 54.93,25.08
  pour Top (isolate 0.457): 50.16,16.51 55.24,16.51 59.37,20.64 59.37,30.8 58.1,32.07 54.93,32.07 53.34,33.66 49.53,33.66 47.94,32.07 47.94,30.8 43.81,26.67 43.81,22.86 46.35,22.86 46.35,20 48.9,17.46 49.21,17.46
  pour Bottom (isolate 0.457): 49.85,16.51 55.24,16.51 59.37,20.64 59.37,30.8 58.1,32.07 54.93,32.07 53.34,33.66 49.53,33.66 47.94,32.07 47.94,30.8 47.31,30.16 47.31,29.84 48.58,28.57 50.8,28.57 51.44,27.94 51.44,26.67 50.8,26.04 49.21,26.04 46.35,28.89 46.04,28.89 43.81,26.67 43.81,22.86 46.04,22.86 46.67,22.23 46.67,19.68
AN0  (1 unrouted)
  Top 0.254: AN.2 57.78,21.59 55.88,19.68 51.75,19.68 | IC1.19 49.84,20.02 50.16,19.68 C27.2
AN1
  Top 0.254: AN.1 56.52,28.57 56.52,21.27 55.56,20.32 53.02,20.32 52.7,20.64 52.7,20.95 C26.2 50.8,21.59 49.99,20.82 IC1.20
AN2
  Top 0.254: IC1.21 49.55,21.61 51.44,23.5 C25.2 52.7,24.45 52.7,24.77 AN.4
AN3
  Top 0.254: AN.3 53.98,28.57 53.98,26.99 51.75,24.77 C24.2 50.8,24.45 | IC1.22 49.09,22.41 50.8,24.13 50.8,24.45 | C24.2 50.8,24.45
AN4  (1 unrouted)
  Top 0.254: IC1.24 45.11,25.74 | C23.2 45.09,26.67 45.09,26.99 45.72,27.62 47.94,27.62 49.53,26.04 51.44,26.04 AN.6
AN5
  Top 0.254: IC1.25 44.31,27.16 45.72,28.57 51.44,28.57 AN.5 52.7,31.75 52.39,32.07 C22.2
AN6  (via drill 0.6 pad 1.42)  (1 unrouted)
  Top 0.254: IC1.26 43.51,19.7 v42.86,19.05 | R2.2 C28.2 v22.54,20.64 | R2.2 R1.1 T_LVOLTAGE.TP | D3.3 R2.2
  Bottom 0.254: v42.86,19.05 41.27,19.05 38.73,21.59 23.5,21.59 v22.54,20.64
AN7  (via drill 0.6 pad 1.42)
  Top 0.254: IC1.27 42.71,21.44 v42.23,20.95 | IC3.4 v10.16,12.06 | T_CURRENT.TP C29.2
  Bottom 0.254: v42.23,20.95 40.64,22.54 T_CURRENT.TP 10.16,15.56 v10.16,12.06
CE0
  Top 0.254: U2.16 SPI.4
CE1
  Top 0.254: SPI.5 46.99,51.75 45.09,49.85 U2.15
GPA0  (via drill 0.6 pad 1.42)
  Top 0.254: IC5.21 70.48,42.85 v69.85,42.23
  Bottom 0.254: v69.85,42.23 71.12,42.23 77.79,48.9 80.33,48.9 80.96,49.53 80.96,51.44 IOA.1
GPA1
  Top 0.254: IC5.22 73.35,43.51 78.11,48.26 80.33,48.26 IOA.2
GPA2  (via drill 0.6 pad 1.42)
  Top 0.254: IC5.23 70.19,44.16 v70.48,44.13
  Bottom 0.254: v70.48,44.13 71.44,44.13 75.88,48.58 75.88,50.48 76.83,51.44 78.42,51.44 IOA.3
GPA3
  Top 0.254: IC5.24 72.11,44.8 72.07,44.77 73.34,44.77 77.47,48.9 78.42,48.9 IOA.4
GPA4
  Top 0.254: IC5.25 70.75,45.45 70.17,46.04 70.17,50.8 70.8,51.44 72.71,51.44 73.34,52.07 73.34,53.34 73.98,53.98 75.88,53.98 IOA.5
GPA5
  Top 0.254: IC5.26 72.14,46.1 72.07,46.04 73.34,46.04 77.15,49.85 IOA.6
GPA6
  Top 0.254: IC5.27 71.04,46.76 70.8,46.99 70.8,47.94 71.12,48.26 72.71,48.26 73.34,48.9 73.34,50.8 74.61,52.07 IOA.7
GPA7
  Top 0.254: IC5.28 73.44,47.41 74.61,48.58 IOA.8
GPB0
  Top 0.254: IC5.1 64.95,47.81 65.41,48.26 65.41,51.44 IOB.1
GPB1
  Top 0.254: IC5.2 66.12,46.76 67.31,47.94 67.31,49.53 IOB.2
GPB2
  Top 0.254: IC5.3 64.07,46.1 63.5,46.67 63.5,48.9 62.87,49.53 62.87,50.8 64.14,52.07 IOB.3
GPB3  (via drill 0.6 pad 1.42)
  Top 0.254: IC5.4 64.98,45.48 66.52,45.48 v66.99,45.96
  Bottom 0.254: IOB.4 66.99,47.31 v66.99,45.96
GPB4
  Top 0.254: IC5.5 64.1,44.8 62.87,46.04 62.87,48.26 62.23,48.9 60.96,48.9 60.33,49.53 60.33,51.44 IOB.5
GPB5
  Top 0.254: IC5.6 67.65,44.16 68.26,44.77 68.26,53.02 67.31,53.98 63.5,53.98 62.87,53.34 62.87,52.07 61.59,50.8 IOB.6
GPB6
  Top 0.254: IC5.7 64.13,43.51 62.23,45.4 62.23,47.62 61.59,48.26 59.05,48.26 57.78,49.53 57.78,51.44 IOB.7
GPB7  (via drill 0.6 pad 1.42)
  Top 0.254: 60.96,43.5 63.18,43.5 63.82,42.86 64.95,42.86 IC5.8 | 60.96,43.5 v60.96,46.99 | v61.28,34.29 61.28,35.24 60.64,35.88 60.64,43.18 60.96,43.5
  Bottom 0.254: v60.96,46.99 59.05,48.9 IOB.8 | DRDY.1 59.24,16.07 60.96,17.78 60.96,33.02 61.28,33.34 v61.28,34.29
INTA  (via drill 0.6 pad 1.42)
  Top 0.254: IC5.20 v73.98,42.23 | U2.14 45.74,49.55 46.99,50.8 52.7,50.8 53.34,50.16 v53.34,49.53
  Bottom 0.254: v73.98,42.23 72.07,42.23 70.8,40.96 68.9,40.96 65.09,44.77 56.2,44.77 53.34,47.62 v53.34,49.53
INTB  (via drill 0.6 pad 1.42)
  Top 0.254: IC5.19 73.03,41.59 73.66,40.96 v75.25,40.96 | U2.13 46.39,49.25 47.31,50.16 50.8,50.16 v51.44,49.53
  Bottom 0.254: v75.25,40.96 71.75,40.96 70.8,40.01 68.9,40.01 64.77,44.13 55.88,44.13 51.44,48.58 v51.44,49.53
INTC  (via drill 0.6 pad 1.42)
  Top 0.254: IC2.7 67.63,35.56 66.99,36.2 66.36,36.2 v65.41,37.15 | OPTION0.6 31.75,44.77 33.66,44.77 34.29,44.13 34.29,42.55 34.92,41.91 36.2,41.91 38.42,39.69 v38.42,38.73 R19.1
  Bottom 0.254: U$3.22 29.21,52.07 29.21,48.58 30.48,47.31 OPTION0.6 | v38.42,38.73 40.01,37.15 54.93,37.15 56.52,38.73 60.64,38.73 62.23,37.15 v65.41,37.15
INTD  (via drill 0.6 pad 1.42)
  Top 0.254: IC1.32 38.73,25.08 38.1,25.72 36.83,25.72 v36.51,25.4 | v57.47,36.51 57.47,41.59 54.93,44.13 54.93,46.35 53.02,48.26 50.8,48.26 49.53,49.53 47.31,49.53 47.04,49.27 U2.12
  Bottom 0.254: v36.51,25.4 37.78,26.67 37.78,33.34 40.96,36.51 v57.47,36.51
J_PI_CE1  (via drill 0.6 pad 1.42)
  Top 0.254: U2.6 45.09,41.92 v44.45,41.27 45.72,40.01 46.99,40.01 47.62,40.64 J_CE1B.1
  Bottom 0.254: J_CE1.3 43.88,41.85 v44.45,41.27
J_PI_INTA  (via drill 0.6 pad 1.42)
  Top 0.254: U2.7 45.74,42.05 v46.35,41.27
  Bottom 0.254: J_CE1.1 46.93,41.91 | 46.93,41.91 46.93,41.85 v46.35,41.27 | J_CE1B.3 51.44,45.72 51.75,45.4 51.75,42.55 51.12,41.91 46.93,41.91
MISO
  Top 0.254: SPI.2 39.37,51.12 40.01,50.48 42.23,50.48 43.14,49.57 U2.18
MOSI
  Top 0.254: SPI.1 39.69,49.85 41.59,49.85 41.84,49.6 U2.20
N$1
  Top 0.254: IC1.35 34.79,21.61 RC1.TP
N$2
  Top 0.254: IC1.36 34.78,20.82 RC2.TP
N$3
  Top 0.254: IC1.37 34.78,20.02 RC3.TP
N$7
  Top 0.254: C14.- C15.- 75.28,8.26 76.83,8.26 77.28,8.7 R16.1 79.56,8.7 80.01,8.26 80.01,5.4 79.53,4.92 R11.2
N$8
  Top 0.254: C14.+ INL.1
N$9
  Top 0.406: HP+.1 80.96,19.37 C21.-
N$16
  Top 0.254: IC1.44 32.89,14.41 29.84,17.46 29.84,28.26 29.21,28.89 R9.2
N$19  (via drill 0.6 pad 1.42)
  Top 0.254: IC1.38 32.85,19.21 32.07,20.16 v31.11,20.16
  Bottom 0.254: SX.3 27.94,14.29 28.26,14.61 28.26,15.24 29.84,16.83 29.84,19.21 30.8,20.16 v31.11,20.16
N$22  (via drill 0.6 pad 1.42)
  Top 0.254: IC1.17 45.4,18.41 v44.45,17.46
  Bottom 0.254: v44.45,17.46 45.09,16.83 45.09,14.61 PGD.TP
N$23  (via drill 0.6 pad 1.42)
  Top 0.254: IC1.16 46.51,17.61 44.45,15.56 v43.81,15.56
  Bottom 0.254: v43.81,15.56 41.91,15.56 40.96,14.61 PGC.TP
N$24  (via drill 0.6 pad 1.42)
  Top 0.254: v31.11,18.41 IC1.39
  Bottom 0.254: v31.11,18.41 30.8,18.1 30.8,16.83 28.89,14.92 28.89,11.43 28.26,10.79 SY.3
N$25
  Top 0.254: Q1.1 33.34,31.43 33.66,31.43 33.66,28.89 C11.2 33.66,27.3 34.29,26.67 38.73,26.67 39.51,25.89 IC1.31
N$27
  Top 0.254: Q1.2 43.18,31.43 39.69,31.43 39.69,27.94 | IC1.30 40.31,26.36 39.69,26.99 39.69,27.94 | 39.69,28.25 C10.2 39.69,27.94
N$33
  Top 0.254: IC2.1 65.98,27.72 65.25,26.99 63.5,26.99 Q6.1
N$34
  Top 0.254: Q6.2 64.93,29.21 65.56,29.84 66.99,29.84 67.63,29.21 IC2.2
N$36
  Bottom 0.254: IC7.DRY DRDY.2
N$39
  Top 0.254: PWR.A R14.2
N$40
  Top 0.254: C15.+ 75.22,5.71 74.3,5.71 73.66,5.08 INR.1
N$41
  Top 0.254: R11.1 80.65,2.23 80.96,2.54 80.96,3.81 81.28,4.13 R15.2 82.39,7.37 | IC6.3 83.19,12.7 83.5,12.38 83.5,9.84 82.39,8.73 82.39,7.37 | 82.39,7.37 R16.2
N$42
  Top 0.406: IC6.5 76.46,15.62 75.25,16.83 73.66,16.83 | 73.66,16.83 R3.2 | C21.+ 73.48,17 73.66,16.83
N$43
  Top 0.406: R3.1 C17.1
N$47
  Top 0.254: IC6.7 75.25,11.43 74.93,11.11 74.93,10.79 74.61,10.48 C19.1
N$55
  Top 0.254: IC1.42 34.78,16.02 RC4.TP
N$56
  Top 0.254: IC1.43 34.79,15.21 RC5.TP
N$58
  Top 0.254: 68.9,27.62 IC2.3 68.9,29.21 69.53,29.84 73.98,29.84 76.52,32.38 CR1220.-
OPTION0
  Top 0.254: OPTION0.1 24.45,43.5 24.11,43.16 U1.14
OPTION1
  Top 0.254: OPTION0.2 25.4,45.4 23.8,43.81 U1.15
OPTION2
  Top 0.254: OPTION0.3 26.67,44.77 26.67,46.67 26.04,47.31 24.77,47.31 23.81,46.35 23.18,46.35 22.58,45.76 U1.18
OPTION3  (via drill 0.6 pad 1.42)
  Top 0.254: OPTION0.4 29.21,44.77 29.21,42.23 30.48,40.96 OPTION1.2 | U1.17 23.47,45.11 v23.5,45.09
  Bottom 0.254: OPTION0.4 26.67,47.31 24.77,47.31 23.5,46.04 v23.5,45.09
OPTION4  (via drill 0.6 pad 1.42)
  Top 0.254: OPTION0.5 33.02,40.96 OPTION1.3 | U1.16 v20.64,44.46 v20.64,44.45
  Bottom 0.254: OPTION0.5 29.53,43.5 29.21,43.81 29.21,44.13 28.57,44.77 24.77,44.77 23.81,43.81 21.27,43.81 v20.64,44.45
PI_CE0
  Top 0.254: U$3.24 31.75,54.61 33.66,54.61 34.29,53.98 34.29,50.16 34.92,49.53 36.83,49.53 38.73,47.62 38.73,46.35 39.69,45.4 43.81,45.4 44.44,44.77 U2.5
PI_CE1
  Bottom 0.254: J_CE1.2 45.4,45.09 45.72,45.4 | 45.72,45.4 45.72,47.94 44.13,49.53 36.2,49.53 33.02,52.7 U$3.26 | 45.72,45.4 46.35,44.77 47.94,44.77 48.26,44.45 49.53,44.45 49.85,44.13 J_CE1B.2
PI_INTB  (via drill 0.6 pad 1.42)
  Top 0.254: U$3.15 21.59,52.07 v31.75,52.07 | v44.45,46.99 44.45,45.72 46.39,43.78 U2.8
  Bottom 0.254: v31.75,52.07 31.75,49.53 32.7,48.58 43.81,48.58 44.45,47.94 v44.45,46.99
PI_INTD  (via drill 0.6 pad 1.42)
  Top 0.254: U2.9 47.04,45.98 v46.99,46.04
  Bottom 0.254: U$3.12 16.51,54.61 33.97,54.61 34.61,53.98 34.61,52.07 36.51,50.16 44.77,50.16 46.99,47.94 v46.99,46.04
PI_MISO
  Top 0.254: U$3.21 27.94,49.85 29.53,48.26 36.2,48.26 37.47,46.99 37.47,45.72 39.05,44.13 42.86,44.13 43.14,43.85 U2.3
PI_MOSI
  Top 0.254: U$3.19 25.4,50.48 26.04,49.85 26.67,49.85 28.89,47.62 35.88,47.62 36.83,46.67 36.83,45.4 39.43,42.8 U2.1
PI_OPTION0
  Top 0.254: U$3.7 11.11,49.85 12.06,49.85 13.02,48.9 13.02,47.62 13.97,46.67 13.97,46.04 14.61,45.4 14.61,43.5 14.95,43.16 U1.7
PI_OPTION1
  Top 0.254: U$3.11 13.65,49.21 13.65,47.94 14.61,46.99 14.61,46.35 15.24,45.72 15.24,44.13 15.56,43.81 U1.6
PI_OPTION2
  Top 0.254: U$3.13 17.78,49.85 17.14,49.21 17.14,46.04 16.86,45.76 U1.3
PI_OPTION3
  Top 0.254: U$3.16 19.05,52.07 19.05,49.85 17.78,48.58 17.78,45.72 17.17,45.11 U1.4
PI_OPTION4  (via drill 0.6 pad 1.42)
  Top 0.254: v17.62,42.7 17.62,44.13 17.3,44.46 U1.5
  Bottom 0.254: U$3.18 21.59,52.07 19.68,52.07 19.05,51.44 19.05,49.85 17.62,48.42 v17.62,42.7
PI_SCL
  Top 0.254: U$3.5 8.57,49.85 9.53,49.85 10.16,49.21 11.75,49.21 12.38,48.58 12.38,47.31 13.34,46.35 13.34,45.72 13.97,45.09 13.97,42.86 14.32,42.51 U1.8
PI_SCLK
  Top 0.254: U$3.23 30.48,49.85 31.43,48.9 36.51,48.9 38.1,47.31 38.1,46.04 39.37,44.77 43.5,44.77 43.79,44.47 U2.4
PI_SDA
  Top 0.254: U$3.3 6.67,49.21 9.21,49.21 9.84,48.58 11.43,48.58 11.75,48.26 11.75,46.99 12.7,46.04 12.7,45.4 13.34,44.77 13.34,42.55 14.02,41.86 U1.9
RX_PI  (via drill 0.6 pad 1.42)
  Top 0.254: R9.1 R10.2 24.45,31.75 v25.4,32.7
  Bottom 0.254: U$3.10 11.43,52.07 11.43,49.85 14.29,46.99 14.29,41.91 20.64,35.56 22.86,35.56 25.4,33.02 v25.4,32.7
RX_PIC  (via drill 0.6 pad 1.42)
  Top 0.254: IC1.1 37.55,12.62 36.51,13.65 32.7,13.65 29.21,17.14 29.21,26.99 v28.57,27.62 | U1.20 20.39,47.06 v20.32,46.99
  Bottom 0.254: v28.57,27.62 26.67,29.53 26.67,33.34 23.5,36.51 20.95,36.51 19.21,38.26 19.21,42.86 18.57,43.5 18.57,46.2 19.37,46.99 v20.32,46.99
SCL  (via drill 0.6 pad 1.42)
  Top 0.254: IC5.12 66.36,40.24 66.44,40.24 67.31,39.37 67.31,37.15 68.9,35.56 IC2.6 v68.9,32.07 | v25.08,40.01 25.08,41.91 24.48,42.51 U1.13
  Bottom 0.254: IC7.SCL 64.77,19.37 65.41,20 65.41,26.04 68.9,29.53 v68.9,32.07 68.9,35.56 66.04,38.42 64.77,38.42 64.14,37.78 62.55,37.78 60.96,39.37 56.2,39.37 54.61,37.78 41.27,37.78 39.05,40.01 37.15,40.01 36.2,40.96 34.29,40.96 33.02,42.23 | OPTION0.7 33.02,42.23 | 33.02,42.23 32.07,41.27 26.35,41.27 v25.08,40.01
SCLK
  Top 0.254: SPI.3 41.91,51.75 43.79,49.87 U2.17
SDA  (via drill 0.6 pad 1.42)
  Top 0.254: U1.12 23.23,41.86 v23.81,41.27 | IC5.13 63.73,39.6 v63.18,39.05 | v70.17,35.88 IC2.5
  Bottom 0.254: IC7.SDA 64.77,16.83 66.36,18.41 66.36,25.72 70.17,29.53 v70.17,35.88 66.67,39.37 63.5,39.37 v63.18,39.05 62.23,40.01 55.88,40.01 54.29,38.42 41.59,38.42 39.37,40.64 37.47,40.64 36.2,41.91 34.92,41.91 34.29,42.55 34.29,44.13 33.66,44.77 33.02,44.77 | v23.81,41.27 24.77,42.23 31.11,42.23 31.75,42.86 31.75,44.13 32.38,44.77 33.02,44.77 | OPTION0.8 33.02,44.77
SS0  (via drill 0.6 pad 1.42)
  Top 0.254: IC1.40 32.85,17.61 v32.38,17.14
  Bottom 0.254: v32.38,17.14 31.59,16.35 31.27,16.35 29.53,14.61 29.53,9.53 28.89,8.89 23.81,8.89 23.5,8.57 20.64,8.57 20,7.94 S0.3
SS1  (via drill 0.6 pad 1.42)
  Top 0.254: v33.34,15.72 33.97,16.35 33.97,16.51 34.29,16.83 36.1,16.83 IC1.41
  Bottom 0.254: v33.34,15.72 31.59,15.72 30.16,14.29 30.16,9.21 29.21,8.26 24.13,8.26 23.5,7.62 S1.3
SS2
  Top 0.254: IC1.2 38.71,11.4 37.15,9.84 33.97,9.84 33.02,8.89 27.94,8.89 26.99,7.94 S2.3
SS3
  Top 0.254: S3.3 30.48,7.62 31.11,8.26 33.34,8.26 34.29,9.21 37.47,9.21 39.51,11.25 IC1.3
SS4
  Top 0.254: IC1.4 40.31,11.1 37.78,8.57 34.61,8.57 33.97,7.94 S4.3
SS5
  Top 0.254: IC1.5 41.11,10.95 37.47,7.3 S5.3
SS6
  Top 0.254: IC1.8 43.51,12.39 | 43.51,12.39 43.5,12.38 | 43.51,12.39 43.51,11.42 46.35,8.57 47.94,8.57 48.9,7.62 S6.3
SS7
  Top 0.254: IC1.9 44.31,11.57 46.67,9.21 51.44,9.21 52.39,8.26 S7.3
SS8
  Top 0.254: IC1.10 45.11,11.72 46.99,9.84 54.29,9.84 55.88,8.26 S8.3
SS9
  Top 0.254: IC1.11 45.91,11.88 47.31,10.48 54.61,10.48 56.52,8.57 58.74,8.57 59.37,7.94 S9.3
SS10
  Top 0.254: IC1.14 48.76,16.02 49.21,15.56 49.21,12.06 50.16,11.11 54.93,11.11 56.83,9.21 59.05,9.21 60.01,8.26 62.55,8.26 62.87,7.94 S10.3
SS11
  Top 0.254: IC1.15 48.91,16.82 49.85,15.88 49.85,12.38 50.48,11.75 55.24,11.75 57.15,9.84 59.37,9.84 60.33,8.89 65.41,8.89 66.36,7.94 S11.3
TX_PI
  Top 0.254: U$3.8 11.43,52.07 15.88,52.07 16.51,51.44 16.51,49.85 16.19,49.53 16.19,47.06 U1.1
UC_RESET  (via drill 0.6 pad 1.42)
  Top 0.254: IC1.18 45.87,19.21 v45.09,20
  Bottom 0.254: RST.TP 45.09,19.05 v45.09,20
VDD  (via drill 0.6 pad 1.42)
  Top 0.254: R1.2 19.68,26.04 19.05,25.4 v19.05,24.13
  Bottom 0.254: v19.05,24.13 14.92,28.26 J_BATT1.2 14.92,37.15 14.29,37.78 9.02,37.78 J_BATT0.2 7.43,37.91 6.51,38.89 BATT.1
VEE  (via drill 0.6 pad 1.42)
  Top 0.254: IC3.6 11.43,2.22
  Top 1.422: 43.18,6.99 44.13,6.99 46.67,4.45 S6.2 S7.2 S8.2 S9.2 S10.2 S11.2 | 43.18,6.99 C9.+ | 43.18,6.99 42.23,6.99 39.69,4.45 S5.2 S4.2 S3.2 S2.2 S1.2 S0.2 17.14,4.45 v14.92,2.22 11.43,2.22 9.21,2.22 7.75,3.68 RSENSE.2
  Bottom 1.422: v14.92,2.22 14.92,15.24 16.83,17.14 21.59,17.14 22.54,16.19 SX.2 SY.2
VSS  (via drill 0.6 pad 1.42)
  Top 0.254: C7.2 41.59,28.25 41.59,26.35 41.11,25.87 IC1.29 41.12,23.02 39.69,21.59 38.73,21.59 | 42.23,11.11 41.91,11.43 IC1.6 41.91,16.51 38.73,19.68 38.73,21.59 | 36.51,23.81 38.73,21.59 | IC5.16 IC5.17 68.65,40.26 67.31,41.59 64.99,41.59 IC5.10 | U2.11 47.88,48.64 47.94,48.58 | U1.11 21.97,40.7 21.59,40.64
  Top 0.406: 82.55,40.01 82.55,44.77 81.92,45.4 | U$3.6 6.35,53.34 6.35,55.24 | 30.48,55.24 34.61,55.24
  Top 0.813: 72.71,22.54 72.71,23.81
  Bottom 0.254: 57.78,48.58 57.78,50.8 58.42,51.44 59.69,51.44 60.33,50.8 60.33,48.58 | 73.34,48.9 73.34,50.8 73.98,51.44 75.25,51.44 75.88,52.07 75.88,54.61
  Bottom 0.406: 8.89,49.53 8.89,53.34 | 8.89,54.29 8.89,53.34 | 8.89,53.34 U$3.6
  other vias: 56.2,13.97 63.18,25.08 20.64,19.37 17.14,6.67 25.72,37.15 63.5,35.24 17.46,1.91 2.54,48.58 1.91,42.23
  pour Top (isolate 0.457): 1.27,55.24 84.45,55.24 84.45,23.5 67.94,23.5 67.94,11.75 68.58,11.11 68.58,1.27 1.27,1.27
  pour Bottom (isolate 0.457): 1.27,55.24 84.45,55.24 84.45,23.5 67.94,23.5 67.94,11.75 68.58,11.11 68.58,1.27 1.27,1.27
  pour Top (isolate 0.457): 69.22,0.64 84.45,0.64 84.45,22.86 68.58,22.86 68.58,12.06 69.22,11.43
  pour Bottom (isolate 0.457): 69.22,0.64 84.45,0.64 84.45,22.86 68.58,22.86 68.58,12.06 69.22,11.43

### Text on the board
Unrouted: Vérifier si le texte n'est pas trop petit | Vérifier la taille du bornier | Vérifier la taille du potentiomètre son
tNames: INTA | CE1 | 3.3V | Battery / sense | J_BATT | BleuettePi | Rev. 1.0.0 | 5V | Logic / pwr (5V) | Gnd | VBATT | AUDIO | Servo / pwr (~6V) | HP | GND | GY-27 | L | R | GND
bNames: MISO | CE0 | GND | IOB | IOA | MOSI | SCLK | CE1 | 5V | J_BATT | CE1 | INTA | BleuettePi | AN | Logic pwr / (5V) | hugo, 04/2013 | GND | Servo pwr / (~6V) | AUDIO / OUT | AUDIO IN